# EAGLE design IsolatedPowerControl (EAGLE 7.7.0)
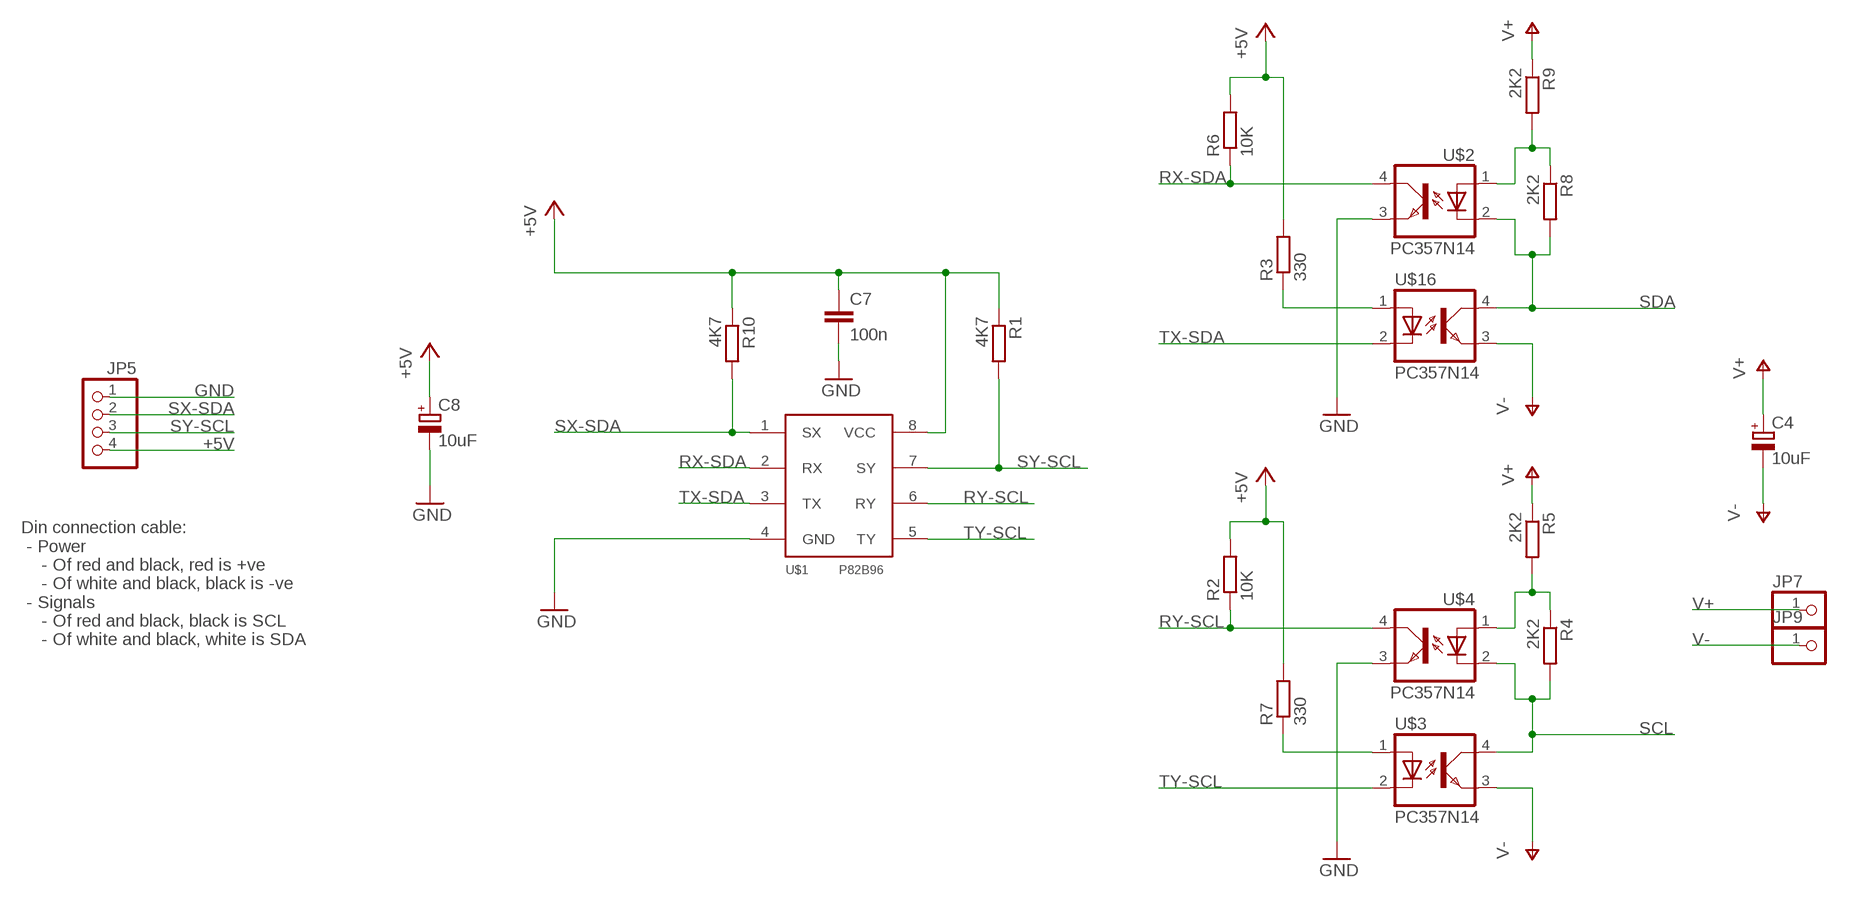
[diagram p0: schematic, sheet 1, part 1 of 2]
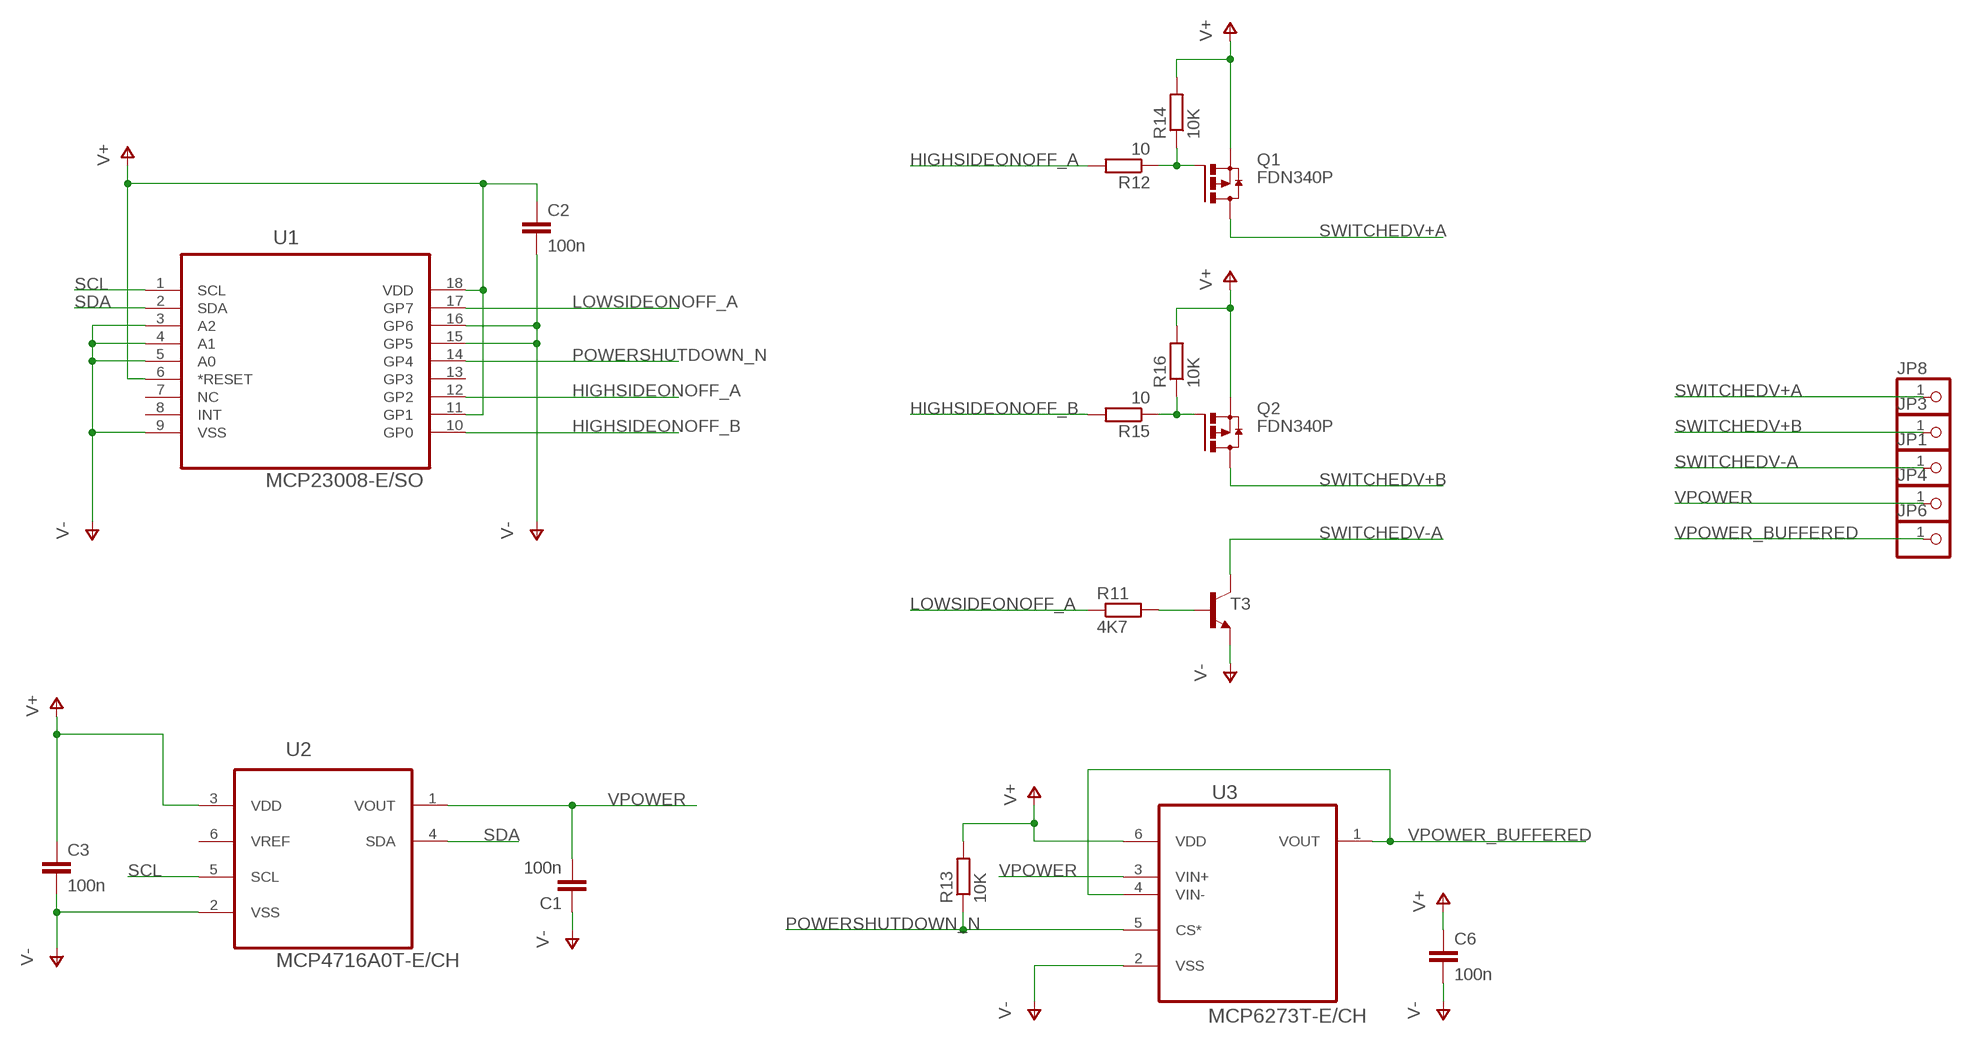
[diagram p1: schematic, sheet 1, part 2 of 2]

## Parts
C1  100n  C-EUC1206K  [C1206K]
C2  100n  C-EUC1206K  [C1206K]
C3  100n  C-EUC1206K  [C1206K]
C4  10uF  CPOL-EUE2-5  [E2-5]
C6  100n  C-EUC1206K  [C1206K]
C7  100n  C-EUC1206K  [C1206K]
C8  10uF  CPOL-EUE2-5  [E2-5]
JP1  PINHD-1X1LARGEPAD  [1X01-LARGEPAD]
JP3  PINHD-1X1LARGEPAD  [1X01-LARGEPAD]
JP4  PINHD-1X1LARGEPAD  [1X01-LARGEPAD]
JP5  PINHD-1X4  [1X04]
JP6  PINHD-1X1LARGEPAD  [1X01-LARGEPAD]
JP7  PINHD-1X1LARGEPAD  [1X01-LARGEPAD]
JP8  PINHD-1X1LARGEPAD  [1X01-LARGEPAD]
JP9  PINHD-1X1LARGEPAD  [1X01-LARGEPAD]
Q1  FDN340P  FDN360P  [SUPER-SOT3]
Q2  FDN340P  FDN360P  [SUPER-SOT3]
R1  4K7  R-EU_R0402  [R0402]
R2  10K  R-EU_R0805  [R0805]
R3  330  R-EU_R0402  [R0402]
R4  2K2  R-EU_R0402  [R0402]
R5  2K2  R-EU_R0402  [R0402]
R6  10K  R-EU_R0805  [R0805]
R7  330  R-EU_R0402  [R0402]
R8  2K2  R-EU_R0402  [R0402]
R9  2K2  R-EU_R0402  [R0402]
R10  4K7  R-EU_R0402  [R0402]
R11  4K7  R-EU_R0402  [R0402]
R12  10  R-EU_R0603  [R0603]
R13  10K  R-EU_R0805  [R0805]
R14  10K  R-EU_R0805  [R0805]
R15  10  R-EU_R0603  [R0603]
R16  10K  R-EU_R0805  [R0805]
T3  MMBTA42LT1-NPN-SOT23-BEC  [SOT23-BEC]
U1  MCP23008-E/SO  [SOIC127P1030X265-18N]
U2  MCP4716A0T-E/CH  [SOT95P270X145-6N]
U3  MCP6273T-E/CH  [SOT95P280X145-6N]
U$1  P82B96  [SOIC8]
U$2  PC357N14  [MINI-FLAT-4-DS]
U$3  PC357N14  [MINI-FLAT-4-DS]
U$4  PC357N14  [MINI-FLAT-4-DS]
U$16  PC357N14  [MINI-FLAT-4-DS]

## Nets
+5V: C7.1 C8.+ JP5.4 R1.1 R2.2 R3.2 R6.2 R7.2 R10.1 U$1.8(VCC)
GND: C7.2 C8.- JP5.1 U$1.4(GND) U$2.3(EMIT) U$4.3(EMIT)
HIGHSIDEONOFF_A: R12.2 U1.12(GP2)
HIGHSIDEONOFF_B: R15.2 U1.10(GP0)
LOWSIDEONOFF_A: R11.1 U1.17(GP7)
N$1: R3.1 U$16.1(A)
N$2: R8.1 R9.2 U$2.1(A)
N$4: R7.1 U$3.1(A)
N$5: R4.1 R5.2 U$4.1(A)
N$7: R11.2 T3.B
N$8: Q2.1(G) R15.1 R16.1
N$12: Q1.1(G) R12.1 R14.1
POWERSHUTDOWN_N: R13.1 U1.14(GP4) U3.5(CS*)
RX-SDA: R6.1 U$1.2(RX) U$2.4(COL)
RY-SCL: R2.1 U$1.6(RY) U$4.4(COL)
SCL: R4.2 U1.1(SCL) U2.5(SCL) U$3.4(COL) U$4.2(C)
SDA: R8.2 U1.2(SDA) U2.4(SDA) U$2.2(C) U$16.4(COL)
SWITCHEDV+A: JP8.1 Q1.3(D)
SWITCHEDV+B: JP3.1 Q2.3(D)
SWITCHEDV-A: JP1.1 T3.C
SX-SDA: JP5.2 R10.2 U$1.1(SX)
SY-SCL: JP5.3 R1.2 U$1.7(SY)
TX-SDA: U$1.3(TX) U$16.2(C)
TY-SCL: U$1.5(TY) U$3.2(C)
V+: C2.1 C3.1 C4.+ C6.1 JP7.1 Q1.2(S) Q2.2(S) R5.1 R9.1 R13.2 R14.2 R16.2 U1.6(*RESET) U1.11(GP1) U1.18(VDD) U2.3(VDD) U3.6(VDD)
V-: C1.1 C2.2 C3.2 C4.- C6.2 JP9.1 T3.E U1.3(A2) U1.4(A1) U1.5(A0) U1.9(VSS) U1.15(GP5) U1.16(GP6) U2.2(VSS) U3.2(VSS) U$3.3(EMIT) U$16.3(EMIT)
VPOWER: C1.2 JP4.1 U2.1(VOUT) U3.3(VIN+)
VPOWER_BUFFERED: JP6.1 U3.1(VOUT) U3.4(VIN-)
Unconnected: U1.7(NC) U1.8(INT) U1.13(GP3) U2.6(VREF)

## Notes on the sheet
- Din connection cable:
   - Power
      - Of red and black, red is +ve
      - Of white and black, black is -ve
   - Signals
      - Of red and black, black is SCL
      - Of white and black, white is SDA

## Library data of the parts
C1-C3 C6 C7 = rcl:C-EU: CAPACITOR, European symbol
C4 C8 = rcl:CPOL-EU: POLARIZED CAPACITOR, European symbol
JP1 JP3 JP4 JP6-JP9 = pinhead:PINHD-1X1: PIN HEADER
JP5 = pinhead:PINHD-1X4: PIN HEADER
Q1 Q2 = transistor-power:FDN360P: Single P-Channel, PowerTrench (R) MOSFET Source: http://www.fairchildsemi.com/ds/FD/FDN360P.pdf
R1-R16 = rcl:R-EU_: RESISTOR, European symbol
T3 = transistor:*-NPN-: NPN Transistror BF959 corrected 2008.03.06
U1 = FarnellMCP23008:MCP23008-E/SO: 8BIT EXPANDER, I/O, I2C I/F; MPN: MCP23008-E/SO; OC_FARNELL: 1332086; OC_NEWARK: 08J8738; PACKAGE: SOIC-18 -Wide; SUPPLIER: Microchip
U2 = MCP4716A0T:MCP4716A0T-E/CH: Digital-to-Analog Converter,SOT23- 6; MPN: MCP4716A0T-E/CH; OC_FARNELL: 1925045; OC_NEWARK: 58T2010; PACKAGE: SOT23- 6; SUPPLIER: MICROCHIP
U3 = MCP6273T-ECH:MCP6273T-E/CH: IC, 170 uA, 2 MHz Rail-to-Rail Op Amp, SOT23-6; MPN: MCP6273T-E/CH; OC_FARNELL: 1852087; OC_NEWARK: 71J5305; PACKAGE: SOT23-6; SUPPLIER: Microchip
U$1 = P82B96:P82B96: P82B96 - I2C buffer
U$2-U$4 U$16 = optocoupler:PC357N14

## Net classes
1 Power: width 0.318 mm, clearance 0.381 mm
3 Ground: width 0.318 mm, clearance 0.381 mm

## Board
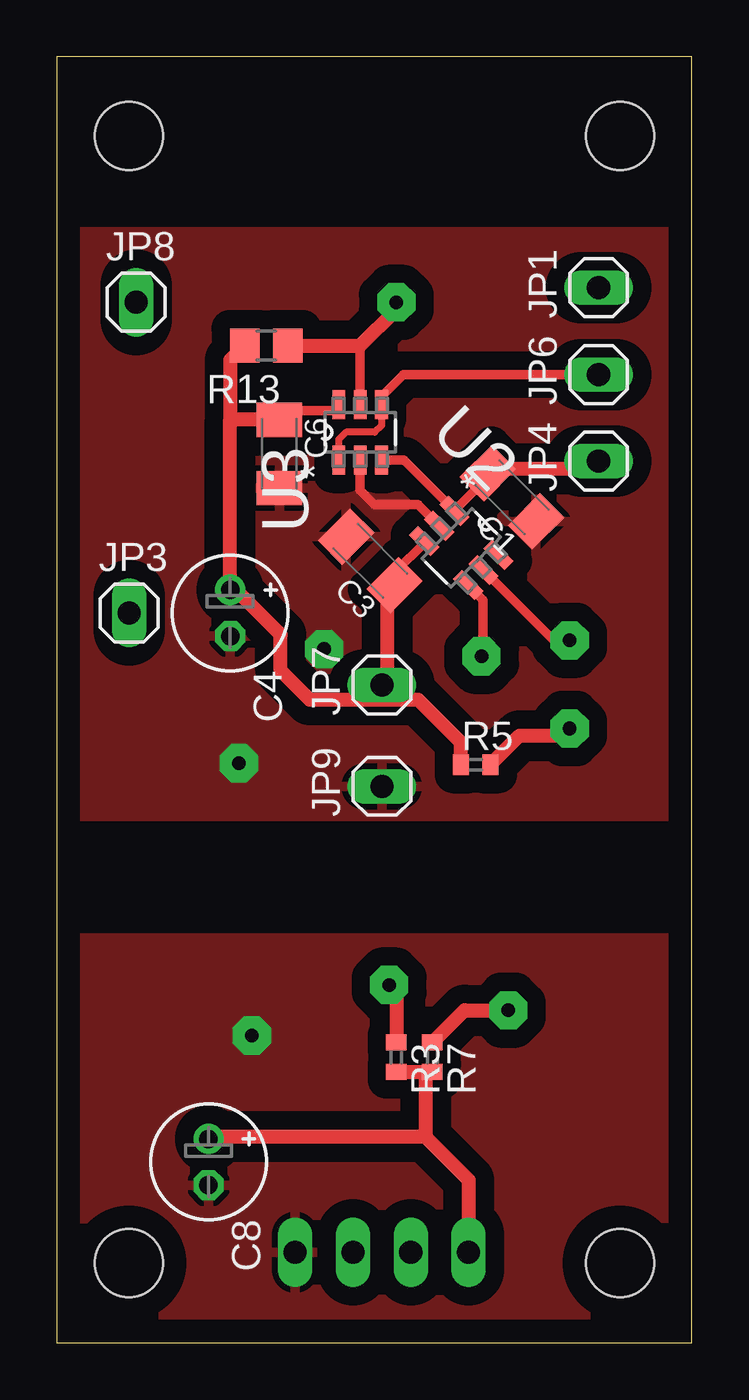
[diagram p2: board, top side]
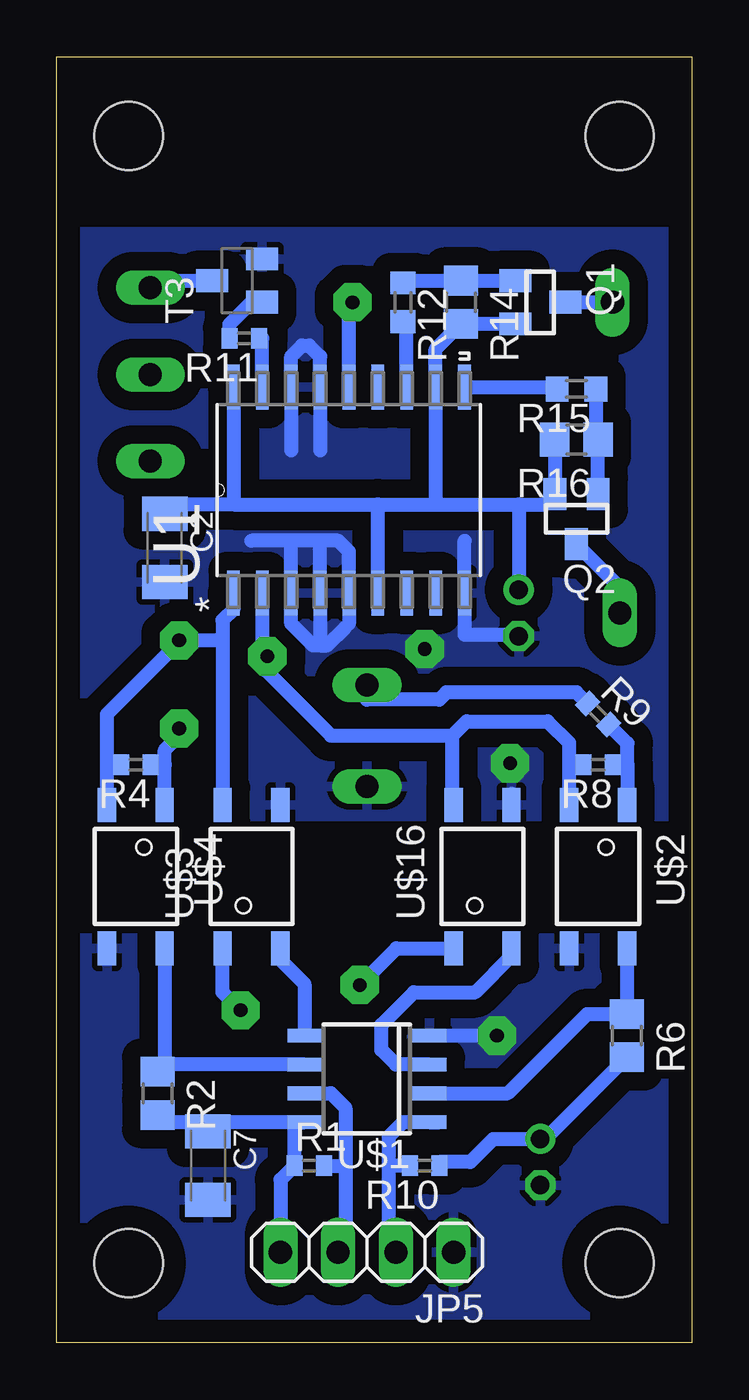
[diagram p3: board, bottom side, seen from below]

Size 27.92 x 56.5 mm. Coordinates in mm from the lower left corner, seen from the top.
Outline: 0,0 27.92,0 27.92,56.5 0,56.5 0,0
Copper layers (1*16): Top 0.035mm / dielectric 1.5mm / Bottom 0.035mm
Design rules "default *": minimum track width 24mil, minimum drill 24mil, track to track 16mil, track to pad 16mil, pad to pad 16mil, via to via 16mil, smd to smd 12.5mil, copper to edge 40mil, drill to drill 8mil, minimum pad ring 10mil, minimum via ring 8mil, stop-mask expansion 4mil, vias tented up to drill 0mil, thermal gap 10mil
Holes 3 mm at 3.17,3.49 24.77,3.49 24.77,53.02 3.17,53.02

### Footprints (pad centres in the part's own frame; a part is rotated, then mirrored left to right if it is on the bottom)
C1206K = smd 1.5 x 2: 1 -1.5,0; 2 1.5,0
E2-5 = drill 0.813 pad 1.27: + -1.016,0 | drill 0.813 pad 1.27 octagon: - 1.016,0
1X01-LARGEPAD = drill 1.016 long: 1 0,0
1X04 = drill 1.016 long: 1 -3.81,0; 2 -1.27,0; 3 1.27,0; 4 3.81,0
SUPER-SOT3 = smd 1 x 1.4: 1 -0.95,-1.1; 2 0.95,-1.1; 3 0,1.1
R0402 = smd 0.7 x 0.9: 1 -0.65,0; 2 0.65,0
R0805 = smd 1.3 x 1.5: 1 -0.95,0; 2 0.95,0
R0603 = smd 1 x 1.1: 1 -0.85,0; 2 0.85,0
SOT23-BEC = smd 1 x 1.4: B -0.95,-1.1; C 0,1.1; E 0.95,-1.1
SOIC127P1030X265-18N = smd 1.981 x 0.559: 1 -4.521,5.08; 2 -4.521,3.81; 3 -4.521,2.54; 4 -4.521,1.27; 5 -4.521,0; 6 -4.521,-1.27; 7 -4.521,-2.54; 8 -4.521,-3.81; 9 -4.521,-5.08; 10 4.521,-5.08; 11 4.521,-3.81; 12 4.521,-2.54; 13 4.521,-1.27; 14 4.521,0; 15 4.521,1.27; 16 4.521,2.54; 17 4.521,3.81; 18 4.521,5.08
SOT95P270X145-6N = smd 1.321 x 0.559: 1 -1.372,0.94; 2 -1.372,0; 3 -1.372,-0.94; 4 1.372,-0.94; 5 1.372,0; 6 1.372,0.94
SOT95P280X145-6N = smd 1.27 x 0.559: 1 -1.219,0.94; 2 -1.219,0; 3 -1.219,-0.94; 4 1.219,-0.94; 5 1.219,0; 6 1.219,0.94
SOIC8 = smd 0.6 x 1.5: 1 -1.905,-2.75; 2 -0.635,-2.75; 3 0.635,-2.75; 4 1.905,-2.75; 5 1.905,2.75; 6 0.635,2.75; 7 -0.635,2.75; 8 -1.905,2.75
MINI-FLAT-4-DS = smd 1.5 x 0.8: 1 -3.15,1.27; 2 -3.15,-1.27; 3 3.15,-1.27; 4 3.15,1.27

### Placement (x,y rotation side)
C1  20,37.15 135 top
C2  23.18,34.92 270 bottom
C3  13.78,34.35 135 top
C4  7.62,32.07 270 top
C6  9.78,39.05 270 top
C7  21.27,7.78 270 bottom
C8  6.67,7.94 270 top
JP1  23.81,46.35 90 top
JP3  3.17,32.07 0 top
JP4  23.81,38.73 90 top
JP5  14.29,3.97 180 bottom
JP6  23.81,42.55 90 top
JP7  14.29,28.89 90 top
JP8  3.49,45.72 0 top
JP9  14.29,24.45 90 top
Q1  6.67,45.72 270 bottom
Q2  5.08,36.2 180 bottom
R1  16.83,7.78 0 bottom
R2  23.5,10.95 270 bottom
R3  14.92,12.54 270 top
R4  24.45,25.4 180 bottom
R5  18.41,25.4 0 top
R6  2.86,13.49 270 bottom
R7  16.51,12.54 270 top
R8  4.13,25.4 180 bottom
R9  4.13,27.62 315 bottom
R10  11.75,7.78 180 bottom
R11  19.68,44.13 180 bottom
R12  12.7,45.72 270 bottom
R13  9.21,43.81 180 top
R14  10.16,45.72 270 bottom
R15  5.08,41.91 180 bottom
R16  5.08,39.69 180 bottom
T3  20,46.67 90 bottom
U1  15.08,37.47 90 bottom
U2  17.78,34.92 315 top
U3  13.34,40.01 90 top
U$1  14.29,11.59 90 bottom
U$2  4.13,20.48 270 bottom
U$3  19.37,20.48 90 bottom
U$4  24.45,20.48 270 bottom
U$16  9.21,20.48 90 bottom

### Tracks (layer width: path | path; a pad name or v marks a point on that pad's centre or on a via)
+5V
  Top 0.61: 16.19,9.05 6.76,9.05 C8.+ | 16.19,9.05 18.1,7.14 JP5.4 | R3.2 16.19,11.89 | 16.19,11.89 16.19,9.05 | 16.19,11.89 R7.2
  Bottom 0.61: 18.1,4.92 JP5.4 18.1,7.16 R1.1 17.48,9.68 | R6.2 6.11,9.29 6.29,9.11 6.45,8.95 C8.+ 8.73,8.95 9.75,7.94 11.1,7.94 R10.1 | 17.48,9.68 U$1.8 | 17.48,9.68 21.27,9.68 | 21.27,9.68 23.5,9.68 R2.2 | C7.1 21.27,9.68
GND  (via drill 0.6 pad 1.68)
  Bottom 0.61: U$2.3 5.4,16.99 | U$1.4 v8.57,13.49
  pour Top (isolate 0.813): 0,0 0,17.78 27.94,17.78 27.94,0
  pour Bottom (isolate 0.813): 0,0 0,17.78 27.94,17.78 27.94,0
HIGHSIDEONOFF_A
  Bottom 0.61: U1.12 12.54,44.71 R12.2
HIGHSIDEONOFF_B
  Bottom 0.61: U1.10 6.01,41.99 R15.2
LOWSIDEONOFF_A
  Bottom 0.61: U1.17 18.89,44.13 R11.1
N$1  (via drill 0.6 pad 1.68)
  Top 0.61: R3.1 14.92,15.4 v14.61,15.72
  Bottom 0.61: U$16.1 12.99,17.33 v14.61,15.72
N$2
  Bottom 0.61: 2.84,25.4 R8.1 | 2.84,25.4 2.84,26.34 R9.2 | 2.84,25.4 2.84,23.64 U$2.1
N$4  (via drill 0.6 pad 1.68)
  Top 0.61: R7.1 17.92,14.61 v19.84,14.61
  Bottom 0.61: U$3.1 20.64,15.4 v19.84,14.61
N$5  (via drill 0.6 pad 1.68)
  Top 0.61: R5.2 20.34,26.67 22.23,26.67 v22.54,26.99
  Bottom 0.61: U$4.1 23.18,25.4 | 23.18,25.4 23.18,26.04 22.54,26.67 v22.54,26.99 | R4.1 23.18,25.4
N$7
  Bottom 0.61: 18.73,45.72 T3.B 19.36,45.72 20.34,44.75 R11.2
N$8
  Bottom 0.61: R15.1 4.23,39.79 R16.1 Q2.1
N$12
  Bottom 0.61: R12.1 12.7,46.67 R14.1 Q1.1
POWERSHUTDOWN_N  (via drill 0.6 pad 1.68)
  Top 0.406: U3.5 13.34,43.81
  Top 0.61: R13.1 13.34,43.81 14.92,45.4 v14.92,45.72
  Bottom 0.61: U1.14 15.08,45.72 v14.92,45.72
RX-SDA
  Bottom 0.61: U$2.4 R6.1 4.61,14.44 8.1,10.95 U$1.2
RY-SCL
  Bottom 0.61: U$4.4 23.18,12.22 | 23.18,12.22 23.18,11.9 R2.1 | U$1.6 23.18,12.22
SCL  (via drill 0.6 pad 1.68)
  Top 0.406: U2.5 21.84,30.86 v22.54,30.86
  Bottom 0.61: U$4.2 25.72,25.4 | R4.2 25.72,25.4 | U1.1 20.16,32.23 20.64,31.75 20.64,30.86 | 20.64,30.86 U$3.4 | 25.72,25.4 25.72,27.62 22.54,30.8 v22.54,30.86 20.64,30.86
SDA  (via drill 0.6 pad 1.68)
  Top 0.406: U2.4 18.73,32.64 18.73,30.23 v18.67,30.16
  Bottom 0.406: 18.73,30.1 v18.67,30.16
  Bottom 0.61: U$16.4 10.54,23.69 10.54,26.67 | U$2.2 5.4,25.4 | 5.4,25.4 5.4,26.35 6.35,27.3 9.91,27.3 10.54,26.67 | R8.2 5.4,25.4 | 18.73,30.1 18.73,29.53 15.88,26.67 10.54,26.67 | U1.2 18.89,30.39 v18.67,30.16
SWITCHEDV+A
  Bottom 0.61: Q1.3 JP8.1
SWITCHEDV+B
  Bottom 0.61: Q2.3 3.17,33.19 JP3.1
SWITCHEDV-A
  Bottom 0.61: JP1.1 23.5,46.67 T3.C
SX-SDA
  Bottom 0.61: 11.11,9.68 U$1.1 12.7,9.68 13.34,9.05 13.34,7.78 | 13.34,7.78 13.34,4.29 JP5.2 | R10.2 13.34,7.78
SY-SCL
  Bottom 0.61: U$1.7 15.88,10.95 15.24,10.32 15.24,7.78 | 15.24,7.78 15.24,4.29 JP5.3 | R1.2 15.24,7.78
TX-SDA
  Bottom 0.61: U$1.3 13.02,12.22 13.65,12.86 13.65,13.97 12.22,15.4 9.53,15.4 7.94,16.99 U$16.2
TY-SCL
  Bottom 0.61: U$3.2 18.1,16.83 17.04,15.77 U$1.5
V+
  Top 0.406: 9.78,40.96 12.39,40.96 U3.6 | U2.3 16.19,35.18 14.84,33.83
  Top 0.61: 9.78,40.96 C6.1 7.62,40.55 | R13.2 7.62,43.18 7.62,40.55 | 14.84,33.83 C3.1 14.52,32.94 14.52,29.13 JP7.1 14.29,28.26 | R5.1 17.77,26.37 15.88,28.26 14.29,28.26 | 14.29,28.26 11.11,28.26 9.84,29.53 9.84,31.11 7.62,33.34 | 7.62,33.34 7.62,40.55 | 7.62,33.34 C4.+
  Bottom 0.61: U1.18 20.16,36.83 | 20.16,36.83 13.81,36.83 | U1.6 13.81,36.83 | 20.16,36.83 23.18,36.83 C2.1 | R9.1 5.08,28.57 10.79,28.57 11.11,28.26 14.29,28.26 JP7.1 | R16.2 Q2.2 6.5,36.83 7.62,36.83 | 13.81,36.83 11.27,36.83 | Q1.2 R14.2 11.27,43.66 U1.11 11.27,36.83 | 11.27,36.83 7.62,36.83 | 7.62,36.83 C4.+
V-  (via drill 0.6 pad 1.68)
  Top 0.406: U2.2 15.88,36.83 13.97,36.83 13.34,37.47 U3.2
  Bottom 0.61: U$16.3 7.94,24.13 | 16.35,30.64 16.67,30.64 17.62,31.59 U1.3 17.62,35.24 | 16.35,30.64 U1.4 16.35,35.24 | 16.35,35.24 15.56,35.24 15.08,34.77 U1.5 15.08,31.59 | 16.35,35.24 17.62,35.24 | 17.62,35.24 19.37,35.24 | 7.3,31.11 10,31.11 U1.9 10,35.24 | 16.35,39.21 U1.15 16.35,43.34 16.83,43.81 17.14,43.81 17.62,43.34 U1.16 17.62,39.21 | 16.35,30.64 16.03,30.64 15.24,31.43
  other vias: 8,25.46 11.75,30.48
  pour Bottom (isolate 0.813): 0,23.11 0,48.83 27.94,48.83 27.94,23.11
  pour Top (isolate 0.813): 0,23.11 0,48.83 27.94,48.83 27.94,23.11
VPOWER
  Top 0.406: U3.3 15.25,38.79 U2.1 18.94,38.03
  Top 0.61: JP4.1 23.5,38.42 19.15,38.42 C1.2 18.94,38.03
VPOWER_BUFFERED
  Top 0.305: U3.1 12.39,39.7 12.7,40.01 13.97,40.01 14.28,40.31 U3.4
  Top 0.406: JP6.1 15.24,42.55 14.28,41.58 U3.4